# EAGLE design 32u4 Xbee Shield (EAGLE 7.1.0)
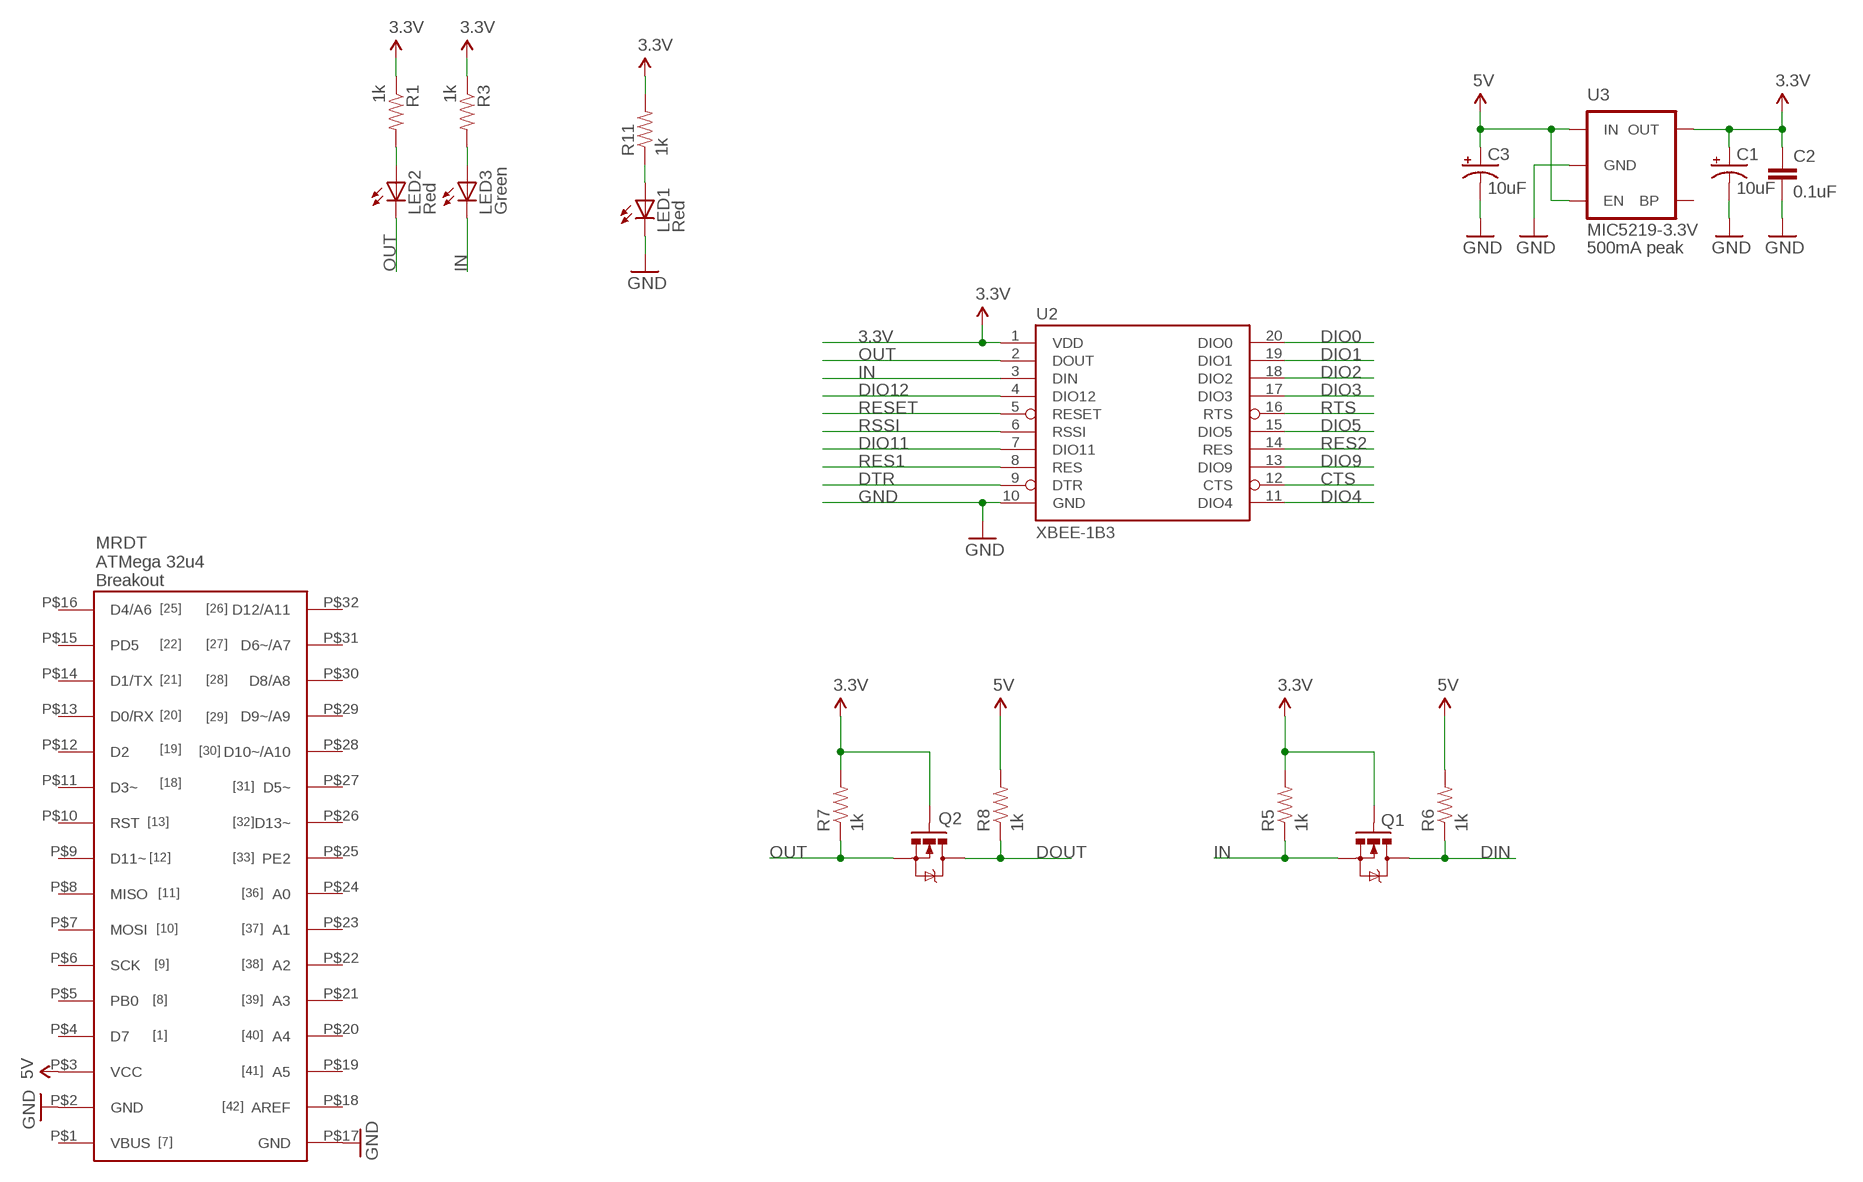
[diagram p0: schematic, sheet 1]

## Parts
C1  10uF  CAP_POL1206  [EIA3216]
C2  0.1uF  CAP1206  [1206]
C3  10uF  CAP_POL1206  [EIA3216]
LED1  Red  LED0603  [LED-0603]
LED2  Red  LED0603  [LED-0603]
LED3  Green  LED0603  [LED-0603]
Q1  MOSFET-NCHANNELSMD  [SOT23-3]
Q2  MOSFET-NCHANNELSMD  [SOT23-3]
R1  1k  RESISTOR1206  [1206]
R3  1k  RESISTOR1206  [1206]
R5  1k  RESISTOR1206  [1206]
R6  1k  RESISTOR1206  [1206]
R7  1k  RESISTOR1206  [1206]
R8  1k  RESISTOR1206  [1206]
R11  1k  RESISTOR1206  [1206]
U2  XBEE-1B3  [XBEE-SMD]
U3  V_REG_LDOSMD  [SOT23-5]
U$1  32U4_BREAKOU_SMD  [32U3_MCU_DIP_SMD]

## Nets
3.3V [vcc]: C1.A(+) C2.1 Q1.1(G) Q2.1(G) R1.1 R3.1 R5.2 R7.2 R11.2 U2.1(VDD) U3.5(OUT)
5V [vcc]: C3.A(+) R6.2 R8.2 U3.1(IN) U3.3(EN) U$1.P$3(VCC)
CTS: U2.12(CTS)
DIN: Q1.3(D) R6.1
DIO0: U2.20(DIO0)
DIO1: U2.19(DIO1)
DIO2: U2.18(DIO2)
DIO3: U2.17(DIO3)
DIO4: U2.11(DIO4)
DIO5: U2.15(DIO5)
DIO9: U2.13(DIO9)
DIO11: U2.7(DIO11)
DIO12: U2.4(DIO12)
DOUT: Q2.3(D) R8.1
DTR: U2.9(DTR)
GND: C1.C(-) C2.2 C3.C(-) LED1.C U2.10(GND) U3.2(GND) U$1.P$2(GND) U$1.P$17(GND)
IN: LED3.C Q1.2(S) R5.1 U2.3(DIN)
N$1: LED2.A R1.2
N$4: LED3.A R3.2
N$38: LED1.A R11.1
OUT: LED2.C Q2.2(S) R7.1 U2.2(DOUT)
RES1: U2.8(RES)
RES2: U2.14(RES)
RESET: U2.5(RESET)
RSSI: U2.6(RSSI)
RTS: U2.16(RTS)
Unconnected: U3.4(BP) U$1.P$1(VBUS) U$1.P$4(D7) U$1.P$5(PB0) U$1.P$6(SCK) U$1.P$7(MOSI) U$1.P$8(MISO) U$1.P$9(D11~) U$1.P$10(RST) U$1.P$11(D3~) U$1.P$12(D2) U$1.P$13(D0/RX) U$1.P$14(D1/TX) U$1.P$15(PD5) U$1.P$16(D4/A6) U$1.P$18(AREF) U$1.P$19(A5) U$1.P$20(A4) U$1.P$21(A3) U$1.P$22(A2) U$1.P$23(A1) U$1.P$24(A0) U$1.P$25(PE2) U$1.P$26(D13~) U$1.P$27(D5~) U$1.P$28(D10~/A10) U$1.P$29(D9~/A9) U$1.P$30(D8/A8) U$1.P$31(D6~/A7) U$1.P$32(D12/A11)

## Notes on the sheet
- MIC5219-3.3V
- 500mA peak

## Library data of the parts
C1 C3 = SparkFun:CAP_POL: Capacitor Polarized These are standard SMD and PTH capacitors. Normally 10uF, 47uF, and 100uF in electrolytic and tantalum varieties. Always verify the external diameter of the through hole cap, it varies with capacity, voltage, and manufacturer. The EIA devices should be standard.
C2 = SparkFun-Passives:CAP: Capacitor Standard 0603 ceramic capacitor, and 0.1" leaded capacitor.
LED1-LED3 = SparkFun:LED: LEDs Standard schematic elements and footprints for 5mm, 3mm, 1206, and 0603 sized LEDs. 5mm - Spark Fun Electronics SKU : COM-00529 (and others)
Q1 Q2 = SparkFun-DiscreteSemi:MOSFET-NCHANNEL: Generic NMOS footprint
R1 R3 R5-R8 R11 = SparkFun-Passives:RESISTOR: Resistor Basic schematic elements and footprints for 0603, 1206, and PTH resistors.
U2 = SparkFun:XBEE-1
U3 = SparkFun:V_REG_LDO: Voltage Regulator LDO Standard 150mA LDO voltage regulator in SOT-23 layout. Micrel part MIC5205. BP (by-pass) pin is used to lower output noise with 470pF cap.
U$1 = MRDT-2015-General:32U4_BREAKOU_SMD

## Net classes
0 default: width 0.203 mm
1 vcc: width 0.305 mm

## Board
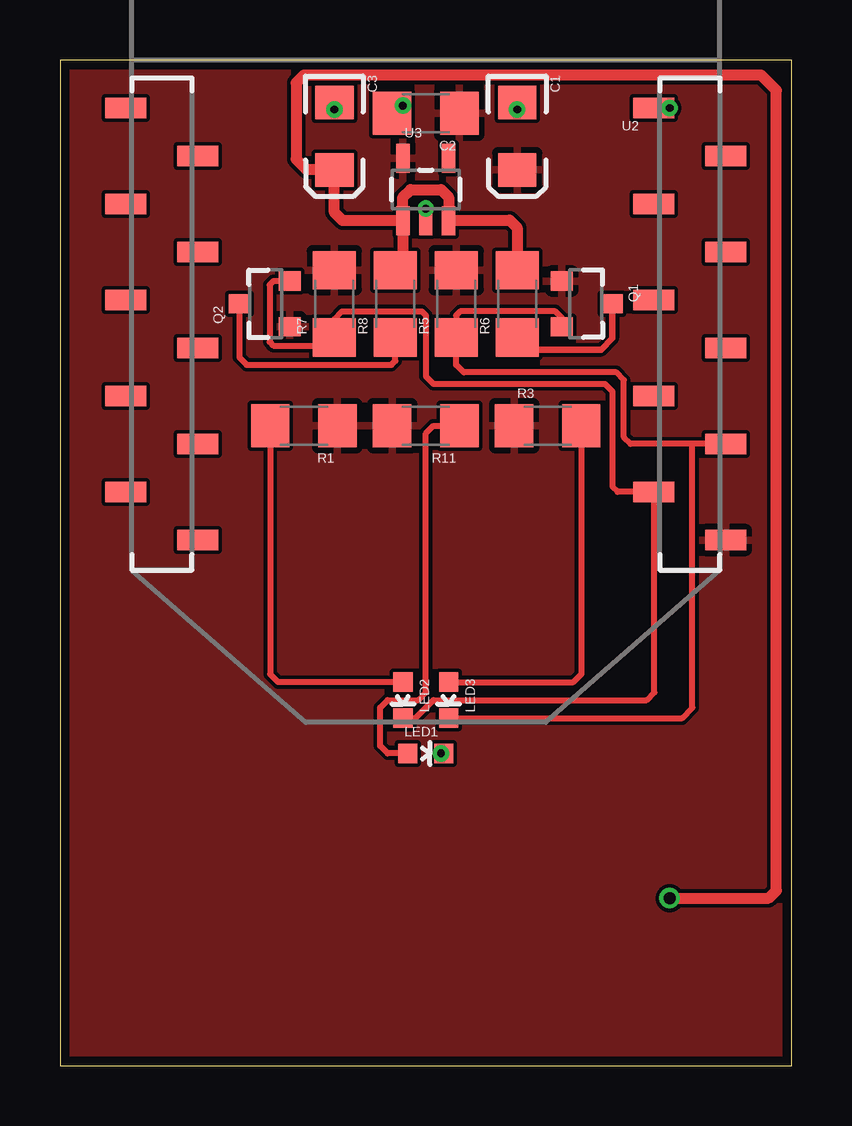
[diagram p1: board, top side]
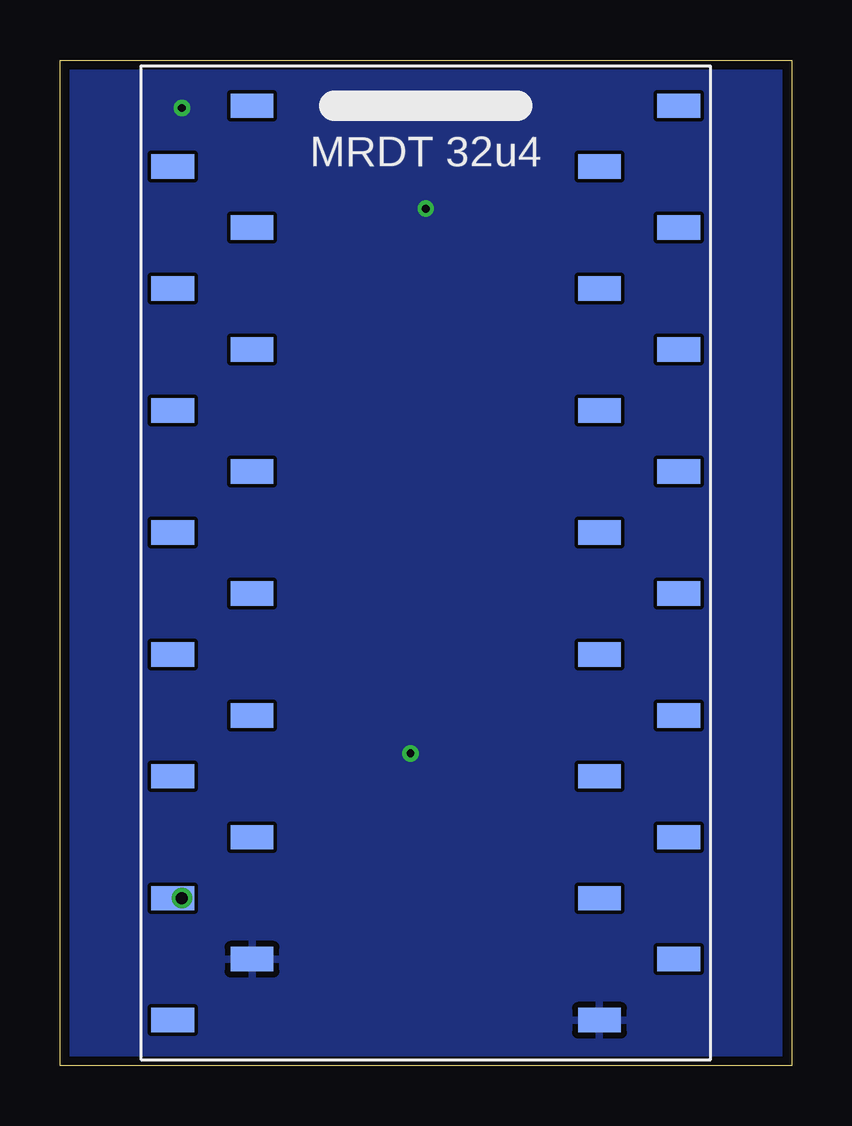
[diagram p2: board, bottom side, seen from below]

Size 30.48 x 41.91 mm. Coordinates in mm from the lower left corner, seen from the top.
Outline: 0,0 30.48,0 30.48,41.91 0,41.91 0,0
Copper layers (1*16): Top 0.0356mm / dielectric 1.5011mm / Bottom 0.0356mm
Design rules "LaenPCBOrder": minimum track width 6mil, minimum drill 13mil, track to track 6mil, track to pad 6mil, pad to pad 6mil, via to via 6mil, smd to smd 6mil, copper to edge 15mil, drill to drill 6mil, minimum pad ring 7mil, minimum via ring 7mil, stop-mask expansion 3mil, vias tented up to drill 0mil, thermal gap 10mil

### Footprints (pad centres in the part's own frame; a part is rotated, then mirrored left to right if it is on the bottom)
EIA3216 = smd 1.4 x 1.6: A 1.4,0; C -1.4,0
1206 = smd 1.6 x 1.8: 1 -1.4,0; 2 1.4,0
LED-0603 = smd 0.8 x 0.8: A 0,-0.75; C 0,0.75
SOT23-3 = smd 0.8 x 0.9: 1 -0.95,-1; 2 0.95,-1; 3 0,1.1
XBEE-SMD = smd 1.7 x 0.85: 1 -12.5,20; 2 -9.5,18; 3 -12.5,16; 4 -9.5,14; 5 -12.5,12; 6 -9.5,10; 7 -12.5,8; 8 -9.5,6; 9 -12.5,4; 10 -9.5,2; 11 12.5,2; 12 9.5,4; 13 12.5,6; 14 9.5,8; 15 12.5,10; 16 9.5,12; 17 12.5,14; 18 9.5,16; 19 12.5,18; 20 9.5,20
SOT23-5 = smd 0.55 x 1.2: 1 -0.95,-1.3; 2 0,-1.3; 3 0.95,-1.3; 4 0.95,1.3; 5 -0.95,1.3
32U3_MCU_DIP_SMD = smd 1.778 x 1.016: P$1 -10.541,-19.05; P$2 -7.239,-16.51; P$3 -10.541,-13.97; P$4 -7.239,-11.43; P$5 -10.541,-8.89; P$6 -7.239,-6.35; P$7 -10.541,-3.81; P$8 -7.239,-1.27; P$9 -10.541,1.27; P$10 -7.239,3.81; P$11 -10.541,6.35; P$12 -7.239,8.89; P$13 -10.541,11.43; P$14 -7.239,13.97; P$15 -10.541,16.51; P$16 -7.239,19.05; P$17 7.239,-19.05; P$18 10.541,-16.51; P$19 7.239,-13.97; P$20 10.541,-11.43; P$21 7.239,-8.89; P$22 10.541,-6.35; P$23 7.239,-3.81; P$24 10.541,-1.27; P$25 7.239,1.27; P$26 10.541,3.81; P$27 7.239,6.35; P$28 10.541,8.89; P$29 7.239,11.43; P$30 10.541,13.97; P$31 7.239,16.51; P$32 10.541,19.05

### Placement (x,y rotation side)
C1  19.05,38.73 270 top
C2  15.24,39.69 180 top
C3  11.43,38.73 270 top
LED1  15.24,13.02 270 top
LED2  14.29,15.24 180 top
LED3  16.19,15.24 180 top
Q1  21.91,31.75 270 top
Q2  8.57,31.75 90 top
R1  10.16,26.67 180 top
R3  20.32,26.67 0 top
R5  16.51,31.75 90 top
R6  19.05,31.75 90 top
R7  11.43,31.75 90 top
R8  13.97,31.75 90 top
R11  15.24,26.67 180 top
U2  15.24,41.91 180 top
U3  15.24,36.51 0 top
U$1  15.24,20.95 0 bottom

### Tracks (layer width: path | path; a pad name or v marks a point on that pad's centre or on a via)
3.3V
  pour Top: -1.27,45.72 -1.27,-1.27 34.29,-1.27 34.29,45.72
5V  (via drill 0.5)
  Top 0.457: 19.18,33.02 R6.2 19.05,34.92 18.73,35.24 16.22,35.24 U3.3 16.19,35.53 16.19,36.2 15.88,36.51 14.61,36.51 14.29,36.2 U3.1 | U3.1 14.29,33.47 R8.2 | U3.1 11.78,35.21 11.43,35.56 C3.A 10.29,37.34 9.84,37.78 9.84,40.96 10.16,41.27 29.21,41.27 29.84,40.64 29.84,7.3 29.53,6.99 v25.4,6.99
  Bottom 0.457: U$1.P$3 v25.4,6.99
DIN
  Top 0.279: Q1.3 23.01,30.31 22.54,29.84 19.68,29.84
  Top 0.305: R6.1 19.18,30.35 19.68,29.84
DOUT
  Top 0.254: Q2.3 7.47,29.52 7.78,29.21 13.81,29.21 13.97,29.37 R8.1
GND  (via drill 0.33)
  Top 0.406: v15.24,35.72 U3.2 | v15.88,13.02 LED1.C | U2.10 v25.4,39.91 | C3.C v11.43,39.85 | v19.05,39.85 C1.C | C2.2 v14.29,40.01
  pour Bottom: -2.54,44.45 -2.54,-2.54 33.02,-2.54 33.02,44.45
IN
  Top 0.254: Q1.2 20.91,31.16 20.64,31.43 16.67,31.43 16.51,31.27 R5.1 16.51,29.21 16.83,28.89 23.18,28.89 23.5,28.57 23.5,26.19 23.78,25.91 26.35,25.91 | U2.3 26.35,25.91 | LED3.C 25.92,14.49 26.35,14.92 26.35,25.91
N$1
  Top 0.254: LED2.A 9.09,15.99 8.76,16.32 R1.2
N$4
  Top 0.254: LED3.A 21.39,15.99 21.72,16.32 R3.2
N$38
  Top 0.254: LED1.A 13.65,13.02 13.34,13.34 13.34,14.92 13.65,15.24 14.92,15.24 15.24,15.56 15.24,26.35 15.56,26.67 R11.1
OUT
  Top 0.254: Q2.2 8.89,32.7 8.73,32.54 8.73,30.16 8.89,30 11.24,30 R7.1 11.43,31.11 11.75,31.43 15.08,31.43 15.24,31.27 15.24,28.73 15.56,28.42 22.7,28.42 23.02,28.1 23.02,24.13 23.24,23.91 U2.2 24.77,23.89 24.77,15.56 24.45,15.24 15.56,15.24 14.81,14.49 LED2.C